# EAGLE schematic PIC32 dev board (EAGLE 6.5.0)
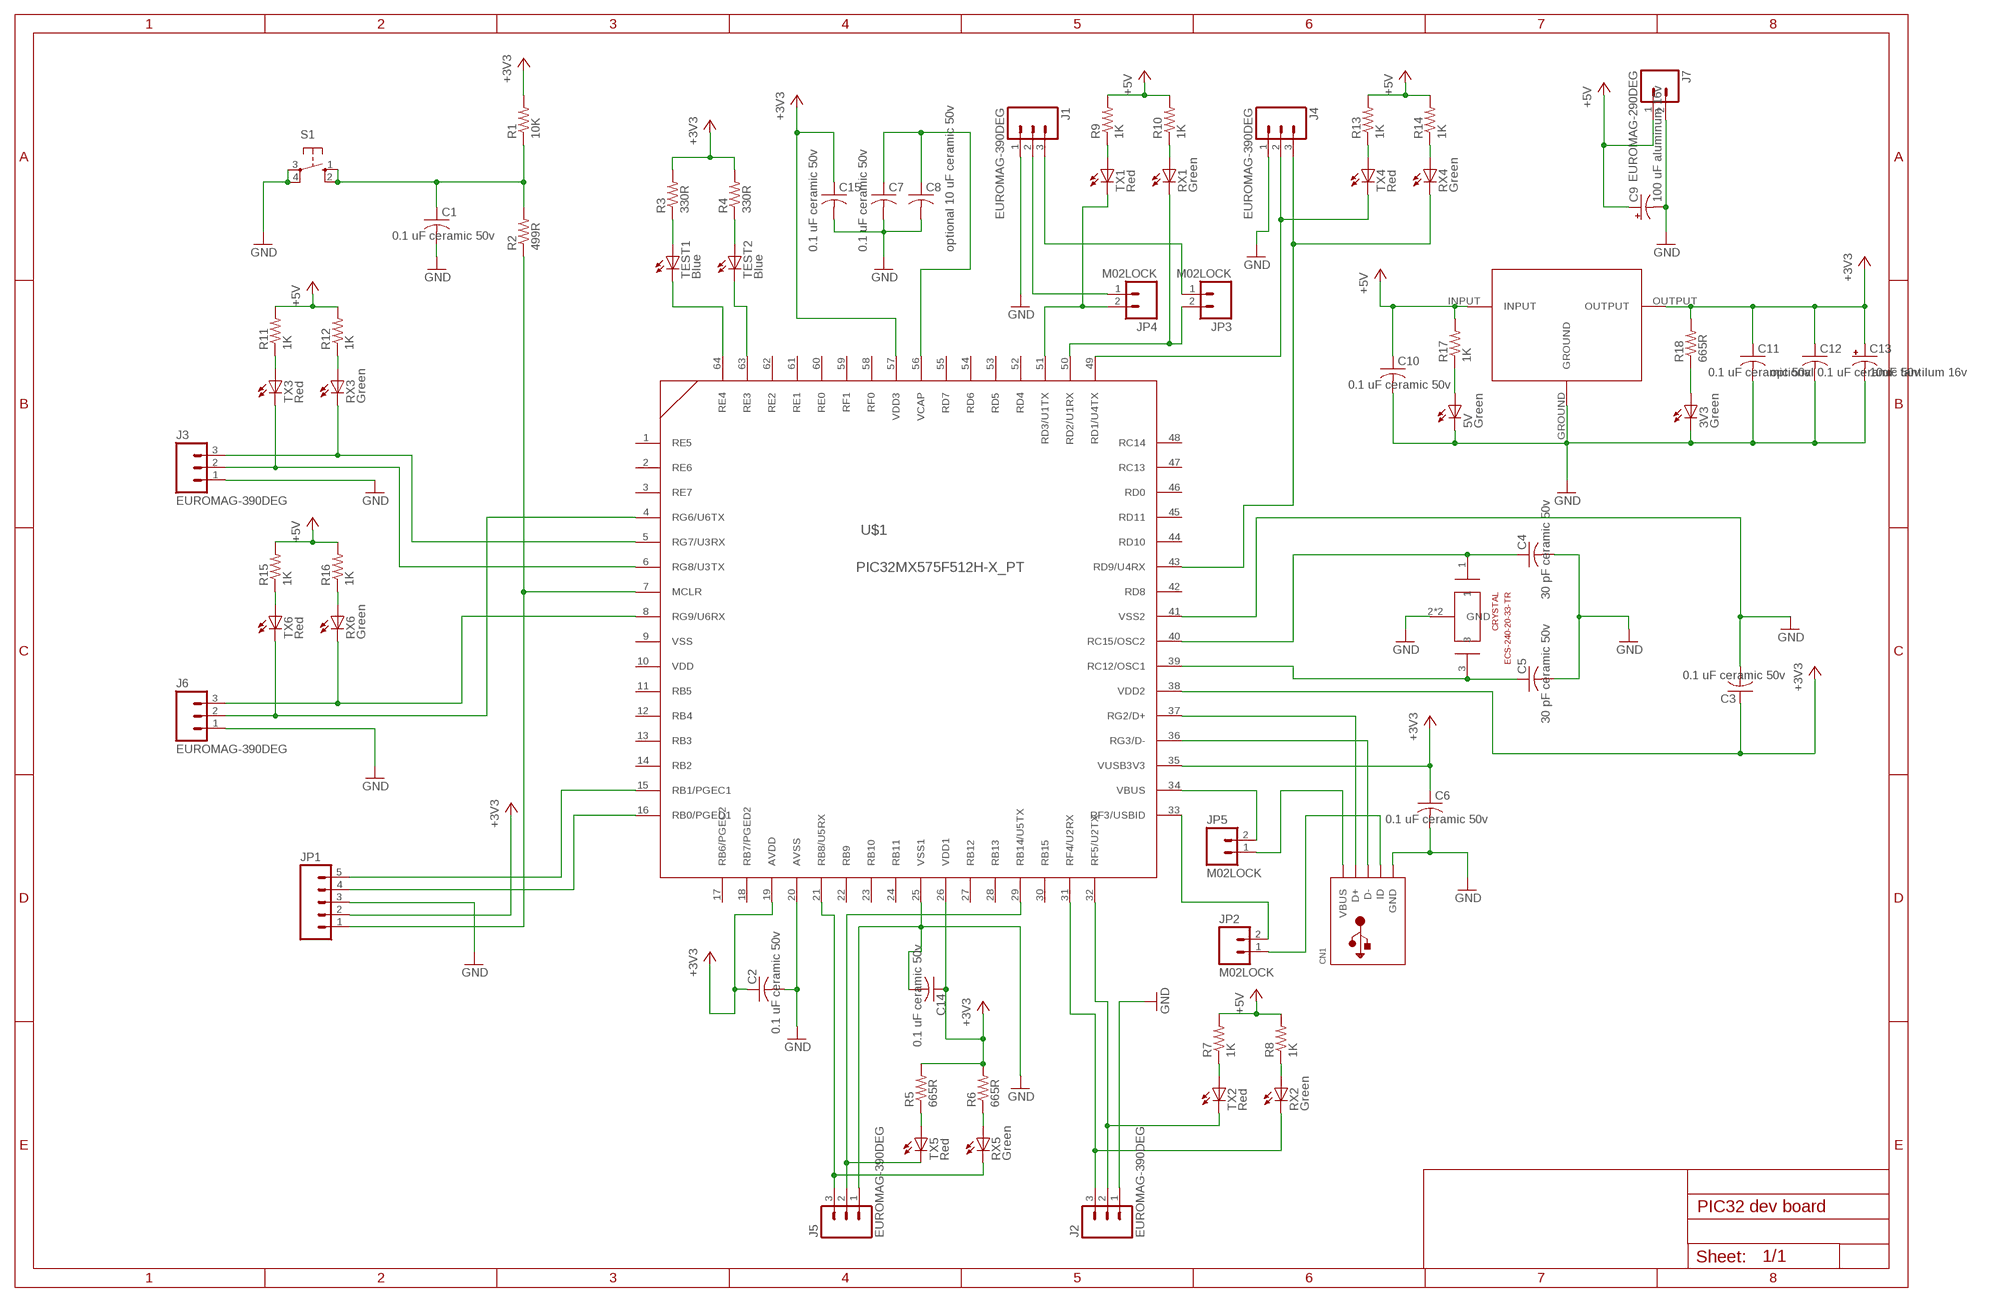
[diagram p0: schematic, sheet 1]

## Parts
3V3  Green  LEDCHIP-LED0805  [CHIP-LED0805]
5V  Green  LEDCHIP-LED0805  [CHIP-LED0805]
C1  0.1 uF ceramic 50v  C-USC0805  [C0805]
C2  0.1 uF ceramic 50v  C-USC0805  [C0805]
C3  0.1 uF ceramic 50v  C-USC0805  [C0805]
C4  30 pF ceramic 50v  C-USC0805  [C0805]
C5  30 pF ceramic 50v  C-USC0805  [C0805]
C6  0.1 uF ceramic 50v  C-USC0805  [C0805]
C7  0.1 uF ceramic 50v  C-USC0805  [C0805]
C8  optional 10 uF ceramic 50v  C-USC0805  [C0805]
C9  100 uF aluminum 16v  CPOL-US153CLV-0605  [153CLV-0605]
C10  0.1 uF ceramic 50v  C-USC0805  [C0805]
C11  0.1 uF ceramic 50v  C-USC0805  [C0805]
C12  optional 0.1 uF ceramic 50v  C-USC0805  [C0805]
C13  10uF tantilum 16v  CPOL-USCT3216  [CT3216]
C14  0.1 uF ceramic 50v  C-USC0805  [C0805]
C15  0.1 uF ceramic 50v  C-USC0805  [C0805]
CN1  USBMINIB  [USB-MINIB]
ECS-240-20-33-TR  CRYSTAL  [ECX-32]
J1  EUROMAG-390DEG  [M3]
J2  EUROMAG-390DEG  [M3]
J3  EUROMAG-390DEG  [M3]
J4  EUROMAG-390DEG  [M3]
J5  EUROMAG-390DEG  [M3]
J6  EUROMAG-390DEG  [M3]
J7  EUROMAG-290DEG  [M2]
JP1  M05LOCK  [1X05_LOCK]
JP2  M02LOCK  [1X02_LOCK]
JP3  M02LOCK  [1X02_LOCK]
JP4  M02LOCK  [1X02_LOCK]
JP5  M02LOCK  [1X02_LOCK]
R1  10K  R-US_M0805  [M0805]
R2  499R  R-US_M0805  [M0805]
R3  330R  R-US_M0805  [M0805]
R4  330R  R-US_M0805  [M0805]
R5  665R  R-US_M0805  [M0805]
R6  665R  R-US_M0805  [M0805]
R7  1K  R-US_M0805  [M0805]
R8  1K  R-US_M0805  [M0805]
R9  1K  R-US_M0805  [M0805]
R10  1K  R-US_M0805  [M0805]
R11  1K  R-US_M0805  [M0805]
R12  1K  R-US_M0805  [M0805]
R13  1K  R-US_M0805  [M0805]
R14  1K  R-US_M0805  [M0805]
R15  1K  R-US_M0805  [M0805]
R16  1K  R-US_M0805  [M0805]
R17  1K  R-US_M0805  [M0805]
R18  665R  R-US_M0805  [M0805]
RX1  Green  LEDCHIP-LED0805  [CHIP-LED0805]
RX2  Green  LEDCHIP-LED0805  [CHIP-LED0805]
RX3  Green  LEDCHIP-LED0805  [CHIP-LED0805]
RX4  Green  LEDCHIP-LED0805  [CHIP-LED0805]
RX5  Green  LEDCHIP-LED0805  [CHIP-LED0805]
RX6  Green  LEDCHIP-LED0805  [CHIP-LED0805]
S1  10-XX  [B3F-10XX]
TEST1  Blue  LEDCHIP-LED0805  [CHIP-LED0805]
TEST2  Blue  LEDCHIP-LED0805  [CHIP-LED0805]
TX1  Red  LEDCHIP-LED0805  [CHIP-LED0805]
TX2  Red  LEDCHIP-LED0805  [CHIP-LED0805]
TX3  Red  LEDCHIP-LED0805  [CHIP-LED0805]
TX4  Red  LEDCHIP-LED0805  [CHIP-LED0805]
TX5  Red  LEDCHIP-LED0805  [CHIP-LED0805]
TX6  Red  LEDCHIP-LED0805  [CHIP-LED0805]
U$1  PIC32MX575F512H-X_PT  [TQFP64_10X10MC]
U$2  LP2950  [TO-252]

## Nets
+3V3: C2.1 C3.1 C6.1 C11.1 C12.1 C13.+ C14.1 C15.1 JP1.2 R1.2 R3.2 R4.2 R5.2 R6.2 R18.2 U$1.19(AVDD) U$1.26(VDD1) U$1.35(VUSB3V3) U$1.38(VDD2) U$1.57(VDD3) U$2.OUTPUT
+5V: C9.+ C10.1 J7.1 R7.2 R8.2 R9.2 R10.2 R11.2 R12.2 R13.2 R14.2 R15.2 R16.2 R17.2 U$2.INPUT
GND: 3V3.C 5V.C C1.2 C2.2 C3.2 C4.2 C5.2 C6.2 C7.2 C8.2 C9.- C10.2 C11.2 C12.2 C13.- C14.2 C15.2 CN1.GND ECS-240-20-33-TR.2(GND) ECS-240-20-33-TR.4(GND) J1.1 J2.1 J3.1 J4.1 J5.1 J6.1 J7.2 JP1.3 S1.3(P) S1.4(P1) U$1.20(AVSS) U$1.25(VSS1) U$1.41(VSS2) U$2.GROUND
N$1: J5.2 TX5.C U$1.29(RB14/U5TX)
N$2: J5.3 RX5.C U$1.21(RB8/U5RX)
N$3: J1.2 JP4.1
N$4: J1.3 JP3.1
N$5: J4.2 TX4.C U$1.49(RD1/U4TX)
N$6: JP3.2 RX1.C U$1.50(RD2/U1RX)
N$7: J2.2 TX2.C U$1.32(RF5/U2TX)
N$8: J2.3 RX2.C U$1.31(RF4/U2RX)
N$9: J3.2 TX3.C U$1.6(RG8/U3TX)
N$10: J3.3 RX3.C U$1.5(RG7/U3RX)
N$11: J6.2 TX6.C U$1.4(RG6/U6TX)
N$12: J6.3 RX6.C U$1.8(RG9/U6RX)
N$13: JP1.1 R2.1 U$1.7(MCLR)
N$14: JP1.4 U$1.16(RB0/PGED1)
N$15: JP1.5 U$1.15(RB1/PGEC1)
N$16: C1.1 R1.1 R2.2 S1.1(S) S1.2(S1)
N$17: C7.1 C8.1 U$1.56(VCAP)
N$18: C4.1 ECS-240-20-33-TR.1 U$1.40(RC15/OSC2)
N$19: C5.1 ECS-240-20-33-TR.3 U$1.39(RC12/OSC1)
N$20: CN1.D+ U$1.37(RG2/D+)
N$21: CN1.D- U$1.36(RG3/D-)
N$22: CN1.VBUS JP5.1
N$23: CN1.ID JP2.1
N$24: TEST2.C U$1.63(RE3)
N$25: TEST1.C U$1.64(RE4)
N$26: R3.1 TEST1.A
N$27: R4.1 TEST2.A
N$28: R5.1 TX5.A
N$29: R6.1 RX5.A
N$30: R7.1 TX2.A
N$31: R8.1 RX2.A
N$32: R9.1 TX1.A
N$33: R10.1 RX1.A
N$34: R11.1 TX3.A
N$35: R12.1 RX3.A
N$36: R13.1 TX4.A
N$37: R14.1 RX4.A
N$38: R15.1 TX6.A
N$39: R16.1 RX6.A
N$40: JP2.2 U$1.33(RF3/USBID)
N$41: JP4.2 TX1.C U$1.51(RD3/U1TX)
N$42: J4.3 RX4.C U$1.43(RD9/U4RX)
N$43: JP5.2 U$1.34(VBUS)
N$46: 5V.A R17.1
N$47: 3V3.A R18.1
Unconnected: U$1.1(RE5) U$1.2(RE6) U$1.3(RE7) U$1.9(VSS) U$1.10(VDD) U$1.11(RB5) U$1.12(RB4) U$1.13(RB3) U$1.14(RB2) U$1.17(RB6/PGEC2) U$1.18(RB7/PGED2) U$1.22(RB9) U$1.23(RB10) U$1.24(RB11) U$1.27(RB12) U$1.28(RB13) U$1.30(RB15) U$1.42(RD8) U$1.44(RD10) U$1.45(RD11) U$1.46(RD0) U$1.47(RC13) U$1.48(RC14) U$1.52(RD4) U$1.53(RD5) U$1.54(RD6) U$1.55(RD7) U$1.58(RF0) U$1.59(RF1) U$1.60(RE0) U$1.61(RE1) U$1.62(RE2)

## Library data of the parts
3V3 5V RX1-RX6 TEST1 TEST2 TX1-TX6 = adafruit:LED: LED OSRAM: - CHIPLED LG R971, LG N971, LY N971, LG Q971, LY Q971, LO R971, LY R971 LH N974, LH R974 LS Q976, LO Q976, LY Q976 LO Q996 - Hyper CHIPLED LW Q18S LB Q993, LB Q99A, LB R99A - SideLED LS A670, LO A670, LY A670, LG A670, LP A670 LB A673, LV A673, LT A673, LW A673 LH A674 LY A675 LS A676, LA A676, LO A676, LY A676, LW A676 LS A679, LY A679, LG A679 - Hyper Micro SIDELED® LS Y876, LA Y876, LO Y876, LY Y876 LT Y87S - SmartLED LW L88C, LW L88S LB L89C, LB L89S, LG L890 LS L89K, LO L89K, LY L89K LS L896, LA L896, LO L896, LY L896 - TOPLED LS T670, LO T670, LY T670, LG T670, LP T670 LSG T670, LSP T670, LSY T670, LOP T670, LYG T670 LG T671, LOG T671, LSG T671 LB T673, LV T673, LT T673, LW T673 LH T674 LS T676, LA T676, LO T676, LY T676, LB T676, LH T676, LSB T676, LW T676 LB T67C, LV T67C, LT T67C, LS T67K, LO T67K, LY T67K, LW E67C LS E67B, LA E67B, LO E67B, LY E67B, LB E67C, LV E67C, LT E67C LW T67C LS T679, LY T679, LG T679 LS T770, LO T770, LY T770, LG T770, LP T770 LB T773, LV T773, LT T773, LW T773 LH T774 LS E675, LA E675, LY E675, LS T675 LS T776, LA T776, LO T776, LY T776, LB T776 LHGB T686 LT T68C, LB T68C - Hyper Mini TOPLED® LB M676 - Mini TOPLED Santana® LG M470 LS M47K, LO M47K, LY M47K Source: http://www.osram.convergy.de/
C1-C8 C10-C12 C14 C15 = rcl:C-US: CAPACITOR, American symbol
C9 C13 = rcl:CPOL-US: POLARIZED CAPACITOR, American symbol
CN1 = adafruit:USB: USB Connectors USBMINIB - Surface Mount Female Mini-B USB Connector 4UConnector: 06564 By microbuilder.eu Thru-hole RA Female Mini-B USB Connector 4UConnector: 18732 By ladyada.net
ECS-240-20-33-TR = Crystal ECS:CRYSTAL
J1-J6 = NASA_LIB:EUROMAG-3
J7 = NASA_LIB:EUROMAG-2
JP1 = SparkFun-Connectors:M05: Header 5 Standard 5-pin 0.1" header. Use with straight break away headers (SKU : PRT-00116), right angle break away headers (PRT-00553), swiss pins (PRT-00743), machine pins (PRT-00117), and female headers (PRT-00115). Molex polarized connector foot print use with SKU : PRT-08230 with associated crimp pins and housings.
JP2-JP5 = SparkFun-Connectors:M02: Standard 2-pin 0.1" header. Use with - straight break away headers ( PRT-00116) - right angle break away headers (PRT-00553) - swiss pins (PRT-00743) - machine pins (PRT-00117) - female headers (PRT-00115) Molex polarized connector foot print use with: PRT-08233 with associated crimp pins and housings. 2.54_SCREWTERM for use with PRT-10571. 3.5mm Screw Terminal footprints for PRT-08084 5mm Screw Terminal footprints for use with PRT-08433
R1-R18 = rcl:R-US_: RESISTOR, American symbol
S1 = switch-omron:10-XX: OMRON SWITCH; MPN: B3F-1000; OC_FARNELL: 176432; OC_NEWARK: 36M3542
U$1 = Pic32:PIC32MX575F512H-X_PT
U$2 = NASA_LIB:LP2950